# Altium schematic sheet JacdacReferenceSchematics 118.SchDoc: Complete design
size A4; DocumentNumber: 1; SheetNumber: 1; SheetTotal: 1; VersionControl_RevNumber: 1
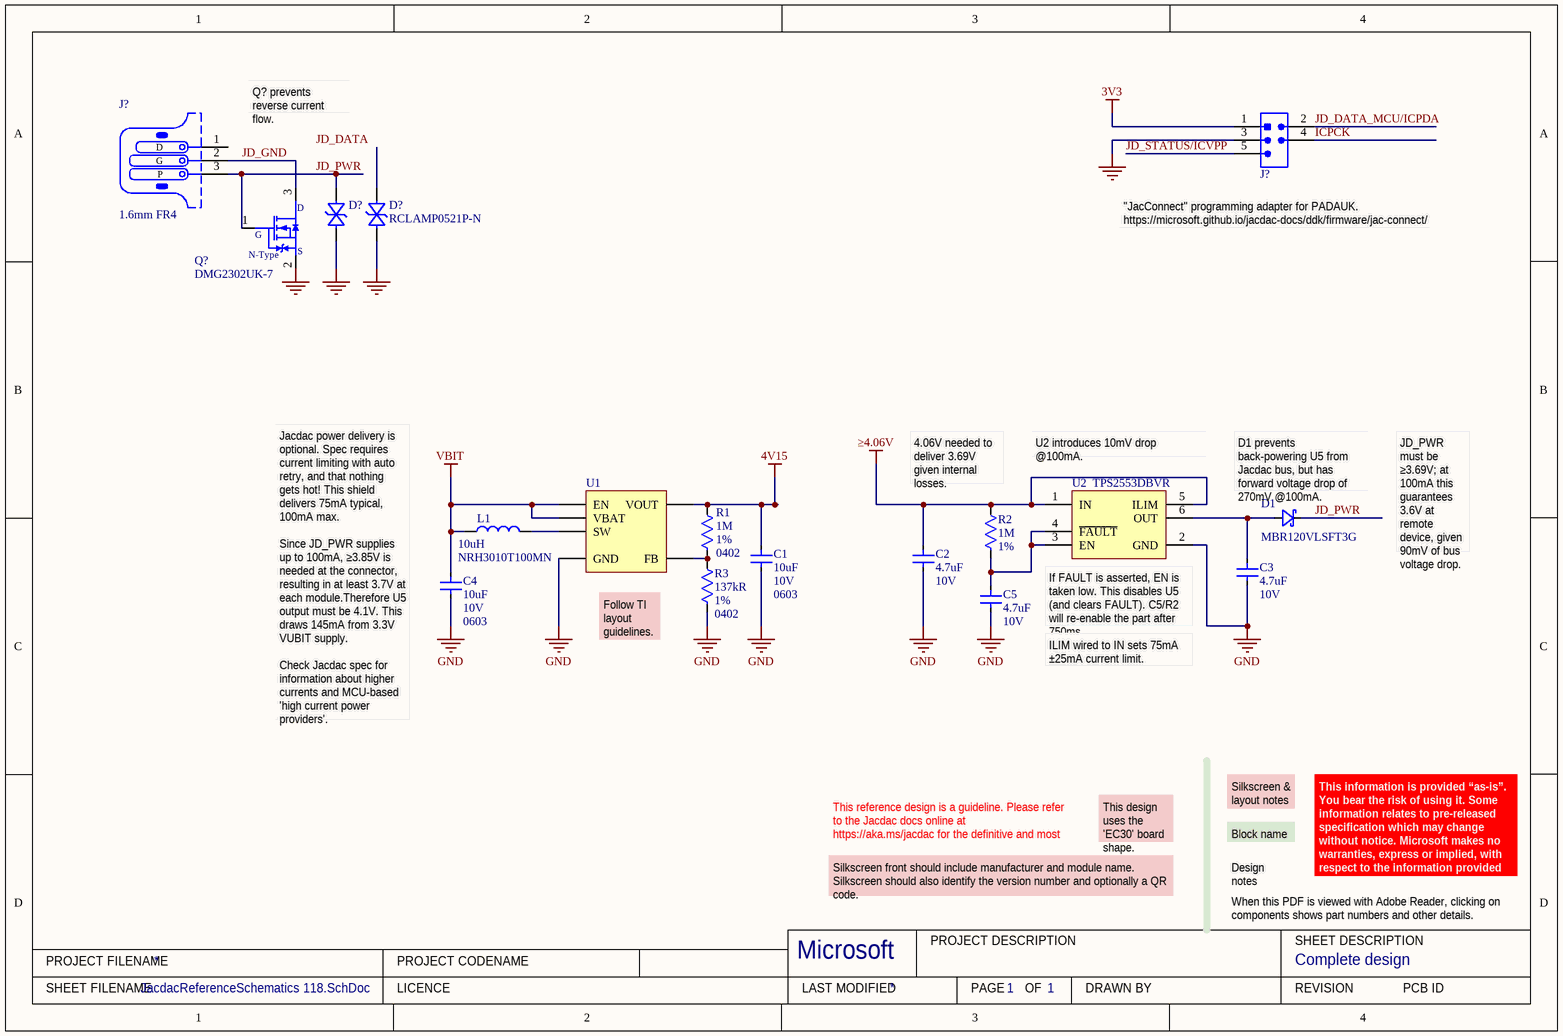
[diagram p0: JacdacReferenceSchematics 118.SchDoc]

## Parts
(Parts that share a designator on the sheet are numbered #1, #2 ... from top to bottom, then left to right.)
C1  Capacitance: 10uF  Voltage Rating: 10V  Case Code (Imperial): 0603  [C0603 - without outline]  (hidden comment: CL10A106KP8NNNC)
C2  Capacitance: 4.7uF  Voltage Rating: 10V  [R0402 - Without outline]  (hidden comment: CL05A475MP5NRNC)
C3  Capacitance: 4.7uF  Voltage Rating: 10V  [R0402 - Without outline]  (hidden comment: CL05A475MP5NRNC)
C4  Capacitance: 10uF  Voltage Rating: 10V  Case Code (Imperial): 0603  [C0603 - without outline]  (hidden comment: CL10A106KP8NNNC)
C5  Capacitance: 4.7uF  Voltage Rating: 10V  [R0402 - Without outline]  (hidden comment: CL05A475MP5NRNC)
D1  MBR120VLSFT3G  [MBR120VLSFT3G]
D?#1  RCLAMP0521P-N  [TVS 0402 - L]  (value not drawn)
D?#2  RCLAMP0521P-N  [TVS 0402 - L]
J?#1  Hack Connect Mini 1.27 mm pitch 2-row  [HACK_CONNECT_MINI_5_X_1_27_0.559mm_TH]  (value not drawn)  (no BOM)
J?#2  PCB Type: 1.6mm FR4  [JACDAC_EDGE_CONNECTOR_NO_TRACES]  (hidden comment: 3 pin JACDAC edge connector)  (no BOM)
L1  Inductance: 10uH  [NRH3010T100MN]  (hidden comment: NRH3010T100MN)
Q?  Manufacturer Part Number: DMG2302UK-7  [DIODES-SOT23-3]  (hidden comment: MOSFET N-CH 20V 2.8A SOT23)
R1  Resistance: 1M  Tolerance: 1%  Case Code (Imperial): 0402  [R0402 - Without outline]  (hidden comment: 0402WGF1004TCE)
R2  Resistance: 1M  Tolerance: 1%  [R0402 - Without outline]  (hidden comment: 0402WGF1004TCE)
R3  Resistance: 137kR  Tolerance: 1%  Case Code (Imperial): 0402  [R0402 - Without outline]  (hidden comment: RC0402FR-07137KL)
U1  TLV61220  [TI-TLV61220 - without_outline]  (value not drawn)
U2  TPS2553DBVR  [TI-TPS2553 - without_outline]

## Nets
3V3: J?#1.1(VCC)
4V15: C1.2 R1.2 U1.5(VOUT)
GND: C1.1 C2.1 C3.1 C4.1 C5.1 D?#1.2(A) D?#2.2(A) J?#1.3(GND) Q?.2(S) R3.1 U1.2(GND) U2.2(GND)
VBIT: C4.2 L1.1 U1.3(EN) U1.6(VBAT)
≥4.06V: C2.2 R2.2 U2.1(IN) U2.5(ILIM)
ICPCK: J?#1.4(SWCLK)
JD_DATA_MCU/ICPDA: J?#1.2(SWDIO)
JD_GND: J?#2.2(G) Q?.3(D)
JD_PWR: D1.1(K) D?#1.1(K) J?#2.3(P) Q?.1(G)
JD_STATUS/ICVPP: J?#1.5(RESET)
NetC3_2: C3.2 D1.2(A) U2.6(OUT)
NetC5_2: C5.2 R2.1 U2.3(EN) U2.4(~{FAULT})
NetL1_2: L1.2 U1.1(SW)
NetR1_1: R1.1 R3.2 U1.4(FB)

Not connected (* = marked no-connect by the designer): D?#2 1(K); J?#2 1(D)

## Notes on the sheet
- Q? prevents reverse current flow.
- (near J?#1) "JacConnect" programming adapter for PADAUK.
  https://microsoft.github.io/jacdac-docs/ddk/firmware/jac-connect/
- (near R2) 4.06V needed to deliver 3.69V given internal losses.
- U2 introduces 10mV drop @100mA.
- (near D1) D1 prevents back-powering U5 from Jacdac bus, but has forward voltage drop of 270mV @100mA.
- JD_PWR must be ≥3.69V; at 100mA this guarantees 3.6V at remote device, given
  90mV of bus voltage drop.
- Follow TI layout guidelines.
- (near U2) If FAULT is asserted, EN is taken low. This disables U5 (and clears FAULT). C5/R2 will re-enable the part after 750ms.
- (near C4) Jacdac power delivery is optional. Spec requires current limiting with auto retry, and that nothing gets hot! This shield delivers 75mA typical, 100mA max.
  Since JD_PWR supplies up to 100mA, ≥3.85V is needed at the connector, resulting in at least 3.7V at each module.Therefore U5 output must be 4.1V. This draws 145mA from 3.3V VUBIT supply.
  Check Jacdac spec for information about higher currents and MCU-based 'high current power providers'.
- ILIM wired to IN sets 75mA ±25mA current limit.
- This reference design is a guideline. Please refer to the Jacdac docs online at https://aka.ms/jacdac for the definitive and most up-to-date information.
- This design uses the 'EC30' board shape.
- Block name
- Silkscreen & layout notes
- Silkscreen front should include manufacturer and module name. Silkscreen should also identify the version number and optionally a QR code.
- Design notes
- When this PDF is viewed with Adobe Reader, clicking on components shows part numbers and other details.
- This information is provided “as-is”. You bear the risk of using it. Some information relates to pre-released specification which may change without notice. Microsoft makes no warranties, express or implied, with respect to the information provided here.
- Labels drawn without touching a wire or pin: JD_DATA
- PROJECT FILENAME
- PROJECT CODENAME
- Microsoft
- PROJECT DESCRIPTION
- SHEET DESCRIPTION
- SHEET FILENAME
- LICENCE
- LAST MODIFIED
- PAGE
- OF
- DRAWN BY
- REVISION
- PCB ID
- (in symbol DMG2302UK-whitesch) N-Type

## Library data of the parts
C1 C4 = CL10A106KP8NNNC: CAP CER 10UF 10V X5R 0603; Manufacturer: Samsung; Material: Ceramic; Tolerance: 10%; Supplier 1: Digi-Key; Manufacturer Part Number: CL10A106KP8NNNC; RoHS: Yes; Category: Ceramic Capacitors; Stock 1: 1098575; Pricing 1: 1=0.21000, 10=0.14800, 50=0.08420, 100=0.06980, 500=0.04892, 1000=0.04050 (USD); Mount: Surface Mount; Case/Package: 0603; Case Code (Metric): 1608; Contact Plating: Tin; Min Operating Temperature: -55°C; Max Operating Temperature: 85°C; Dielectric: X5R; Package Quantity: 1; Packaging: Tape and Reel; Length: 1.6mm; Width: 0.031inch; Height: 0.8mm; Thickness: 0.035inch; Depth: 0.8mm; Radiation Hardening: No; Lead Free: Lead Free; ComponentLink1URL: https://datasheet.ciiva.com/26877/getdatasheetpartid-359551-26877881.pdf; ComponentLink1Description: Online datasheet; Supplier 2: Mouser; Stock 2: 194338; Pricing 2: 1=0.19000, 10=0.13200, 100=0.06700, 500=0.04500, 1000=0.04000, 2500=0.03400 (USD); Supplier 3: Farnell; Stock 3: 11777; Pricing 3: 10=0.08380, 100=0.06930, 500=0.04170, 1000=0.03410, 2000=0.03370, 4000=0.02700, 20000=0.02200 (GBP); Supplier Part Number 3: 3013386; Supplier Part Number 2: 187-CL10A106KP8NNNC; Supplier Part Number 1: 1276-1192-1-ND; Voltage Rating (DC): 10V
C2 C3 C5 = CL05A475MP5NRNC: CAP CER 4.7UF 10V X5R 0402; Manufacturer: Samsung; Tolerance: 20%; Supplier 1: Digi-Key; Manufacturer Part Number: CL05A475MP5NRNC; RoHS: Yes; Category: Ceramic Capacitors; Stock 1: 840000; Pricing 1: 10000=0.01405, 20000=0.01338 (USD); Mount: Surface Mount; Case/Package: 0402; Case Code (Metric): 1005; Min Operating Temperature: -55°C; Max Operating Temperature: 85°C; Package Quantity: 10000; Packaging: Tape and Reel; Dielectric: X5R; Series: CL; Length: 0.039inch; Width: 0.02inch; Thickness: 0.022inch; Lead Free: Lead Free; RoHS Compliant: Yes; ComponentLink1URL: https://datasheet.ciiva.com/25786/cl05a475mp5nrnc-25786963.pdf; ComponentLink1Description: Online datasheet; Supplier 2: Future Electronics; Stock 2: 2004; Pricing 2: 1=0.23500, 500=0.03970, 1500=0.02900, 2500=0.02500, 5000=0.02050 (USD); Created By: D. Gakure; Checked By: ?; Supplier Part Number 2: 2103694; Supplier Part Number 1: 1276-1482-2-ND; Case Code (Imperial): 0402
D1 = MBR120VLSFT3G: DIODE SCHOTTKY 20V 1A SOD123FL; Manufacturer: ON Semiconductor; Max Surge Current: 45A; Forward Voltage: 340mV; Peak Reverse Current: 600uA; Element Configuration: Single; Polarity: Standard; Supplier 1: Digi-Key; RoHS: Yes; Category: Schottky Diodes; Stock 1: 32481; Pricing 1: 1=0.39000, 10=0.28600, 100=0.19920, 500=0.12616, 1000=0.10292, 2000=0.09960, 5000=0.09628 (USD); Number of Pins: 2; Min Operating Temperature: -65°C; Max Operating Temperature: 125°C; Package Quantity: 10000; Forward Current: 1A; Packaging: Tape and Reel; Max Reverse Leakage Current: 600uA; Average Rectified Current: 1A; Peak Non-Repetitive Surge Current: 45A; Max Repetitive Reverse Voltage (Vrrm): 20V; Max Forward Surge Current (Ifsm): 45A; Voltage Rating (DC): 20V; Current Rating: 1A; Output Current: 1A; Max Reverse Voltage (DC): 20V; Radiation Hardening: No; REACH SVHC: No SVHC; Lead Free: Lead Free; Halogen Free: Halogen Free; ComponentLink4URL: https://datasheet.ciiva.com/6380/mbr120vlsft1-d-6380910.pdf; ComponentLink4Description: On Semi datasheet online; Supplier 2: Mouser; Supplier 3: RSComponents; Supplier Part Number 3: 1867479; Supplier Part Number 2: 863-MBR120VLSFT3G; Supplier Part Number 1: MBR120VLSFT3GOSCT-ND; Manufacturer Part Number: MBR120VLSFT3G
D?#1 D?#2 = RCLAMP0521P-N: Bidirectional 5V (Max) 6V 16V 3.5A (8/20us) 0402 TVS RoHS; Manufacturer: Born Semiconductor; Package: 0402; Created By: D Gakure; Checked By: ?; Supplier1: LCSC; Supplier1 Part Number: C316043; ComponentLink1Description: Online datasheet; ComponentLink1URL: https://datasheet.lcsc.com/szlcsc/Bourne-Semicon-Shenzhen-RCLAMP0521P-N_C316043.pdf; Manufacturer Part Number: RCLAMP0521P-N
J?#1 = HACK_CONNECT_MINI
J?#2 = Jacdac edge connector: 3 pin Jacdac edge connector 1.27mm pitch; Manufacturer Part Number: JACDAC_EDGE_CONNECTOR; Checked By: ?; Created By: D. Gakure; ComponentLink1Description: Yuliang JACDAC cable connector drawing online; ComponentLink1URL: https://github.com/microsoft/jacdac-mdk/blob/main/connector/JACDAC-Connector-by-Yuliang-2020-11-28.pdf; ComponentLink2Description: JACDAC PCB edge connector spec onlin; ComponentLink2URL: https://github.com/microsoft/jacdac-mdk/blob/main/connector/JACDAC_PCB_Edge_Connector_Drawing_JD-PEC-01_rev_01.pdf
L1 = NRH3010T100MN: Inductor, Shielded, 10uH, 600mA, SMD; NRH Series; Inductance:10 H; Inductance Tolerance: 20%; Inductor Construction:Shielded; DC Resistance Max:0.35ohm; RMS Current (Irms):620mA; Saturation Current (Isat):600mA ;RoHS Compliant: Yes; Manufacturer: Taiyo Yuden; Core Material: Ferrite; DC Resistance (DCR): 350mR; Test Frequency: 100kHz; Self Resonant Frequency: 34MHz; Current Rating: 620mA; Supplier 1: Digi-Key; RoHS: Yes; Category: Fixed Inductors; Stock 1: 2000; Pricing 1: 1=0.31000, 10=0.27600, 25=0.24120, 50=0.20680, 100=0.18950, 250=0.17224, 500=0.16192, 1000=0.12402 (USD); Mount: Surface Mount; Case/Package: 3010; Min Operating Temperature: -25°C; Max Operating Temperature: 120°C; Max DC Current: 600mA; Tolerance: 20%; Termination: SMD/SMT; Package Quantity: 2000; Packaging: Tape and Reel; Shielding: Shielded; Composition: Wirewound; Saturation Current: 600mA; RMS Current (Irms): 620mA; Length: 3mm; Height: 1mm; Height - Seated (Max): 0.039inch; Depth: 3.1mm; Width: 3mm; Radiation Hardening: No; Halogen Free: Halogen Free; Lead Free: Lead Free; REACH SVHC: Unknown; ComponentLink2URL: https://datasheet.ciiva.com/1043/nrh3010t100mn-ss-1043273.pdf; ComponentLink2Description: Taiyo Yuden spec sheet online; ComponentLink3URL: https://datasheet.ciiva.com/8002/wound04-e-8002182.pdf?src-supplier=Element14; ComponentLink3Description: Taiyo Yuden data sheet (2015) online; Supplier 2: Mouser; Supplier Part Number 2: 963-NRH3010T100MN; Supplier Part Number 1: 587-2575-1-ND; Manufacturer Part Number: NRH3010T100MN
Q? = DMG2302UK-whitesch: Manufacturer: Diodes; Rds On Max: 90mR; Input Capacitance: 130pF; Max Power Dissipation: 660mW; ComponentLink2URL: https://www.diodes.com/assets/Datasheets/DMG2302UK.pdf; ComponentLink2Description: Diodes Inc datasheet online; ComponentLink3Description: Diodes Inc datasheet; ComponentLink3URL: Y:\System\Altium\Libraries 2014\Diodes Inc\Datasheets\DMG2302UK.pdf; Supplier 1: Digi-Key; Stock 1: 37938; Pricing 1: 1=0.34000, 10=0.25000, 100=0.11890, 500=0.09704, 1000=0.07199 (USD); RoHS: Yes; Mount: Surface Mount; Case/Package: TO-236-3; Min Operating Temperature: -55°C; Max Operating Temperature: 150°C; Packaging: Tape and Reel; Drain to Source Voltage (Vdss): 20V; Continuous Drain Current (ID): 2.8A; Supplier 2: Farnell; Supplier 3: Mouser; Supplier 4: RSComponents; Supplier Part Number 1: DMG2302UK-7DICT-ND; Supplier Part Number 2: 3127315; Supplier Part Number 3: 621-DMG2302UK-7; Supplier Part Number 4: 1333362
R1 R2 = 0402WGF1004TCE: RES SMD 1M OHM 1% 1/16W 0402; Manufacturer: Uniroyal Elec; Manufacturer Part Number: 0402WGF1004TCE
  R2: Case Code (Imperial): 0402
R3 = RC0402FR-07137KL: RES SMD 137K OHM 1% 1/16W 0402; Manufacturer: Yageo; Temperature Coefficient: 100ppm/°C; Power Rating: 62.5mW; Voltage Rating: 50V; Max Power Dissipation: 63mW; Supplier 1: Digi-Key; Manufacturer Part Number: RC0402FR-07137KL; RoHS: Yes; Category: Chip SMD Resistors; Stock 1: 47599; Pricing 1: 1=0.10000, 10=0.01600, 100=0.00660, 1000=0.00299, 2500=0.00259, 5000=0.00214 (USD); Case/Package: 0402; Contact Plating: Tin,Matte; Case Code (Metric): 1005; Min Operating Temperature: -55°C; Max Operating Temperature: 155°C; Resistor Type: Thick Film; Packaging: Tape and Reel; Number of Terminations: 2; Termination: SMD/SMT; Working Voltage: 50V; Features: Moisture Resistant; Series: RC; Construction: Rectangular; Technology: THICK FILM; Length: 1mm; Width: 0.02inch; Height: 0.016inch; Depth: 0.5mm; Military Standard: Not; Lead Free: Lead Free; RoHS Compliant: Yes; ComponentLink1URL: https://datasheet.ciiva.com/16744/pyu-rc0402-51-rohs-l-6-r-16744009.pdf; ComponentLink1Description: Online datasheet; Supplier 2: Avnet; Pricing 2: 10000=0.00090, 20000=0.00088, 40000=0.00086, 60000=0.00084, 80000=0.00081, 100000=0.00079, 1000000=0.00077 (USD); Supplier 3: Mouser; Pricing 3: 1=0.10000, 10=0.01600, 50=0.01600, 100=0.00600, 1000=0.00300, 10000=0.00100 (USD); Supplier Part Number 3: 603-RC0402FR-07137KL; Supplier Part Number 2: RC0402FR-07137KL; Supplier Part Number 1: YAG2972CT-ND
U1 = TLV61220: IC REG BST ADJ 0.22A SYNC SOT23; Manufacturer 1: Texas Instruments; Manufacturer Part Number: TLV61220DBVR; Output Voltage: 5.5V; Number of Outputs: 1; Output Current: 200mA; Min Input Voltage: 700mV; Synchronous Rectifier: Yes; Switching Frequency: 2MHz; Max Output Current: 400mA; Output Type: Adjustable; Efficiency: 95%; Min Output Voltage: 1.8V; Quiescent Current: 5uA; Topology: Boost; Output Configuration: Positive; Supplier 1: Digi-Key; RoHS: Yes; Category: Voltage Regulators - Switching; Stock 1: 42159; Pricing 1: 1=0.99000, 10=0.88500, 25=0.84000, 100=0.64500, 250=0.57000, 500=0.54000, 1000=0.42000 (USD); Mount: Surface Mount; Case/Package: SOT-23-6; Number of Pins: 6; Min Operating Temperature: -40°C; Max Operating Temperature: 85°C; Package Quantity: 1; Packaging: Tape and Reel; Max Input Voltage: 5.5V; Max Output Voltage: 5.5V; Length: 3.05mm; Height: 1.3mm; Width: 1.75mm; Radiation Hardening: No; Lead Free: Lead Free; REACH SVHC: No SVHC; ComponentLink5URL: https://www.ti.com/lit/ds/symlink/tlv61220.pdf; ComponentLink5Description: Datasheet (online); Supplier 2: Farnell; Supplier 3: Mouser; Supplier Part Number 3: 595-TLV61220DBVR; Supplier Part Number 2: 3007284; Supplier Part Number 1: 296-30547-1-ND; ComponentLink6Description: Datasheet (offline); ComponentLink6URL: Y:\System\Altium\Libraries 2014\TexasInstruments\datasheets\tlv61220.pdf
U2 = TPS2553DBVR: POWER LOAD SWITCH, HIGH SIDE, SOT-23-6; Power Load Switch Type:High Side; Input Voltage:6.5V; Current Limit:1.7A; On State Resistance:0.085ohm; Distribution Switch Case Style:SOT-23; No. of Pins:6; Thermal Protection:Yes; On / Enable;RoHS Compliant: Yes; Manufacturer 1: Texas Instruments; Number of Outputs: 1; Min Supply Voltage: 2.5V; Max Supply Voltage: 6.5V; On-State Resistance: 85mR; Output Current: 1.5A; Max Power Dissipation: 625mW; Supplier 1: Digi-Key; RoHS: Yes; Category: Hot Swap Controllers; Stock 1: 14713; Pricing 1: 1=1.20000, 10=1.07100, 25=1.01640, 100=0.78050, 250=0.68972, 500=0.65340, 1000=0.50820 (USD); Case/Package: SOT-23; Number of Pins: 6; Weight: 0.00127oz; Min Operating Temperature: -40°C; Max Operating Temperature: 85°C; Packaging: Tape and Reel; Package Quantity: 1; Max Input Voltage: 6.5V; Min Input Voltage: 2.5V; Radiation Hardening: No; Lead Free: Lead Free; REACH SVHC: No SVHC; ComponentLink1URL: https://datasheet.ciiva.com/15108/getdatasheetpartid-297517-15108509.pdf?src-supplier=Verical; ComponentLink1Description: https://datasheet.ciiva.com/15108/getdatasheetpartid-297517-15108509.pdf?src-supplier=Verical; Supplier 2: Farnell; Supplier 3: Mouser; Supplier Part Number 3: 595-TPS2553DBVR; Supplier Part Number 2: 3124082; Supplier Part Number 1: 296-32464-1-ND; Manufacturer Part Number: TPS2553DBVR